# Altium project CSU_Module.PrjPCB
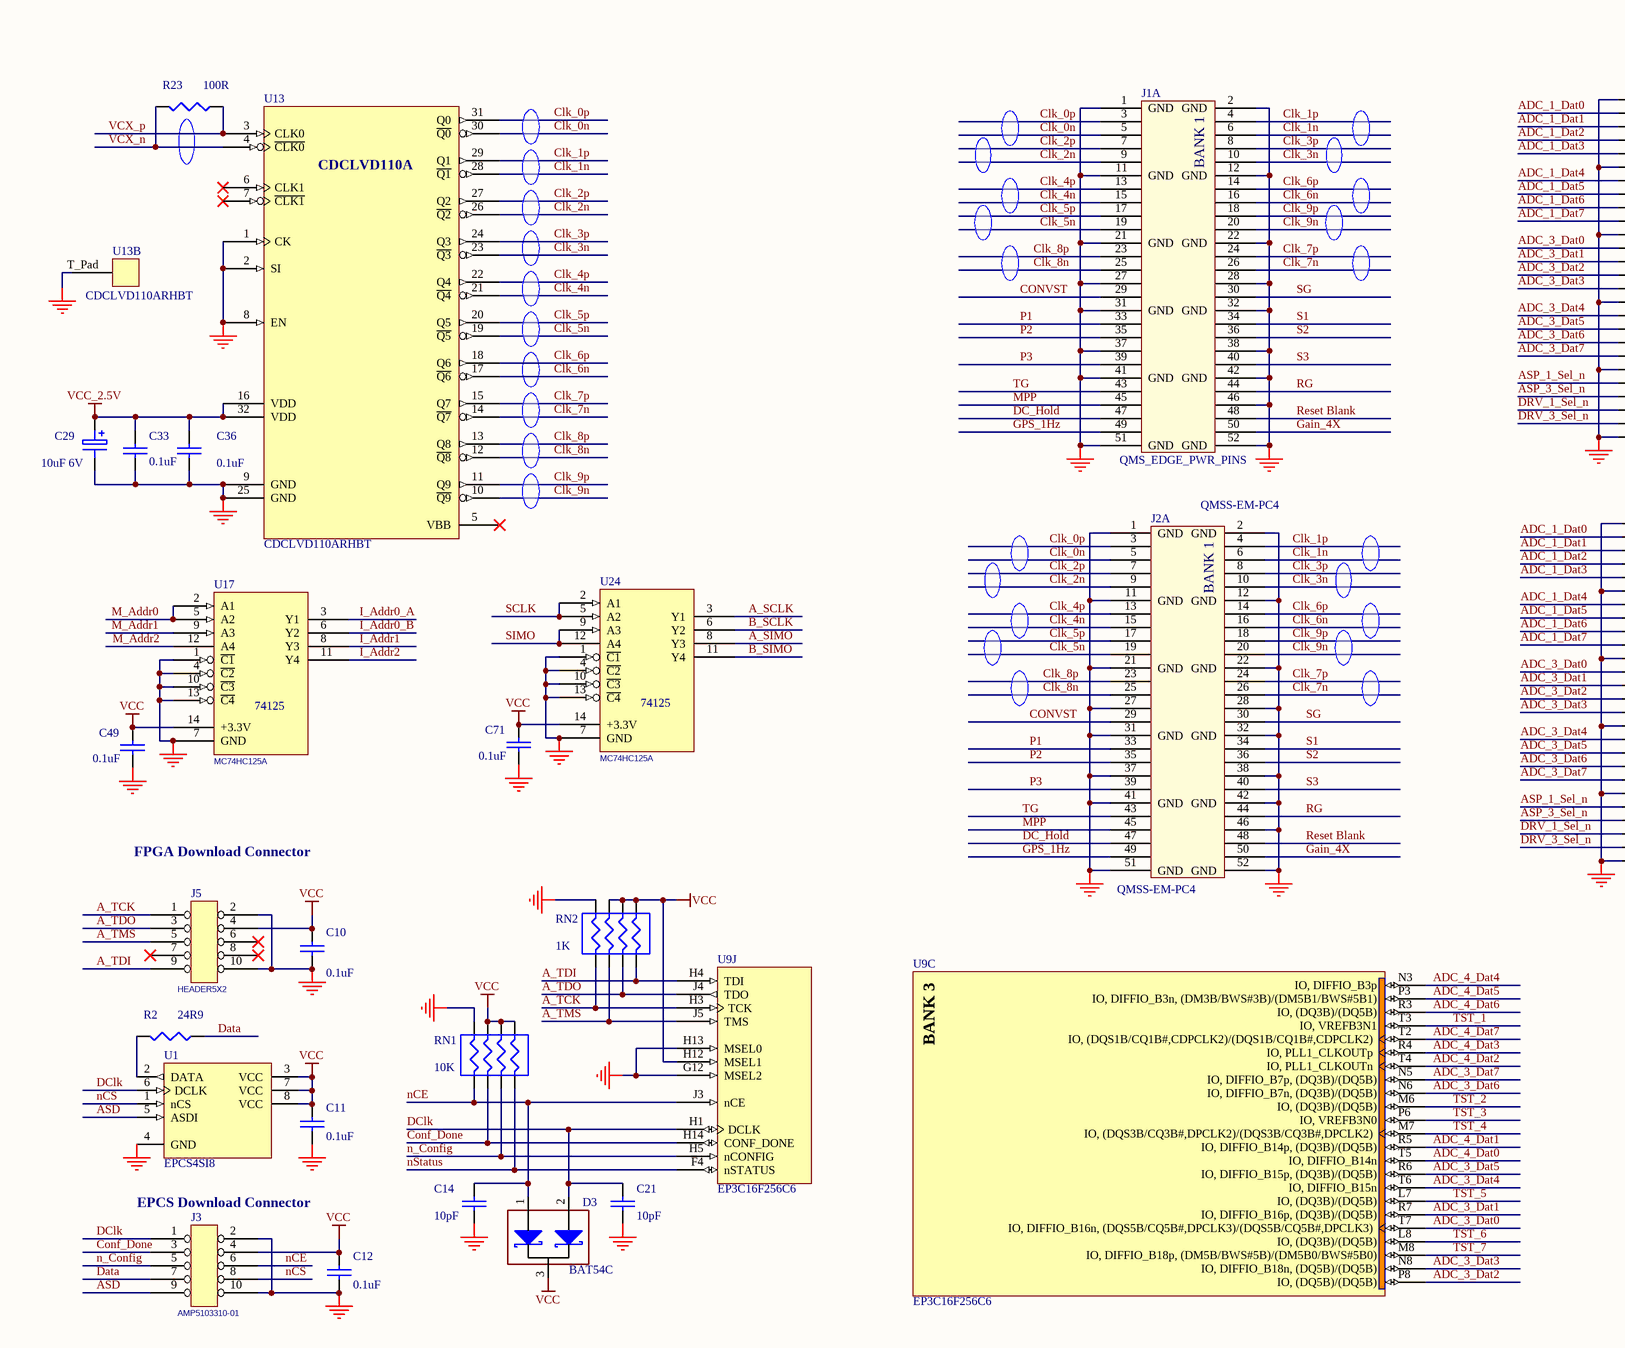
[diagram p0: CSU_FPGA_INTERFACE.SchDoc, top left]
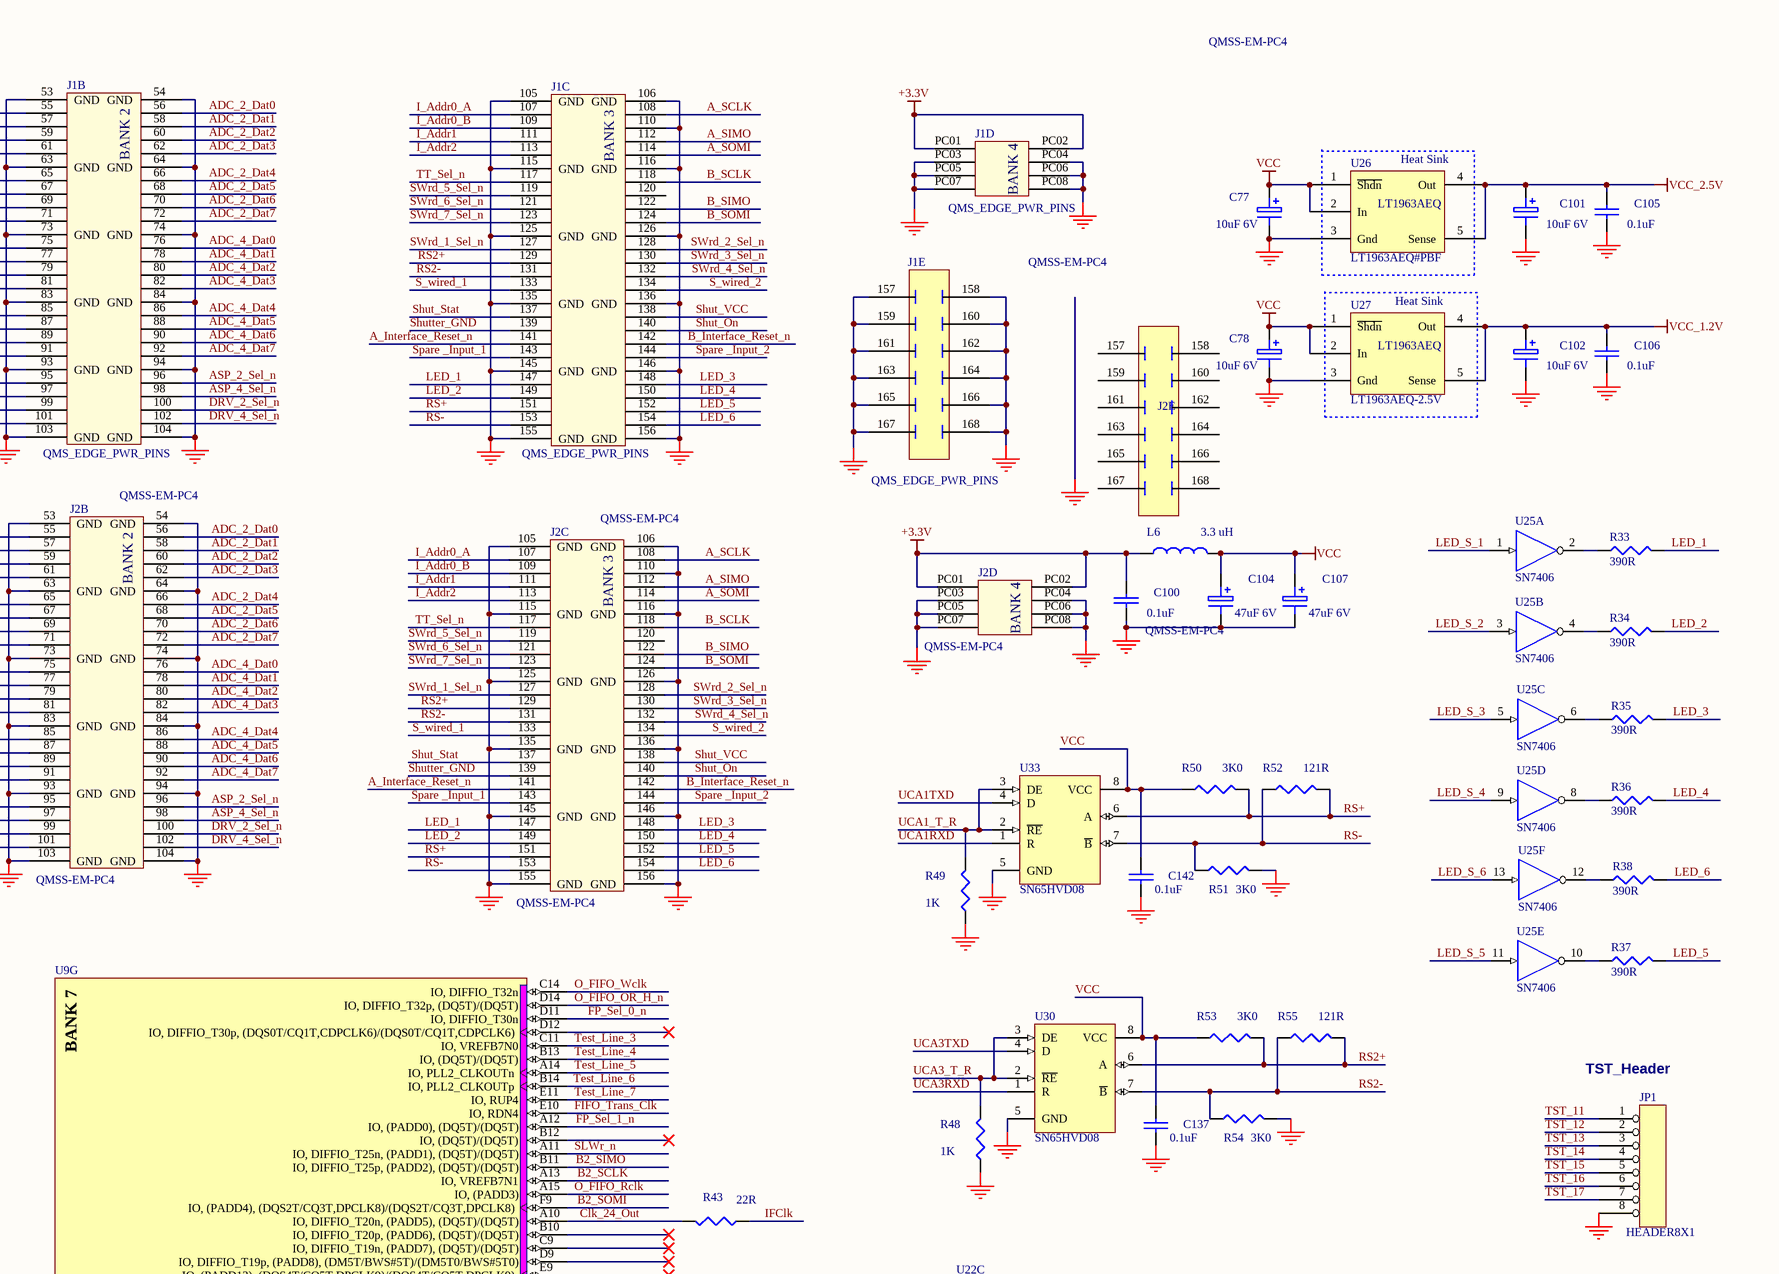
[diagram p1: CSU_FPGA_INTERFACE.SchDoc, top right]
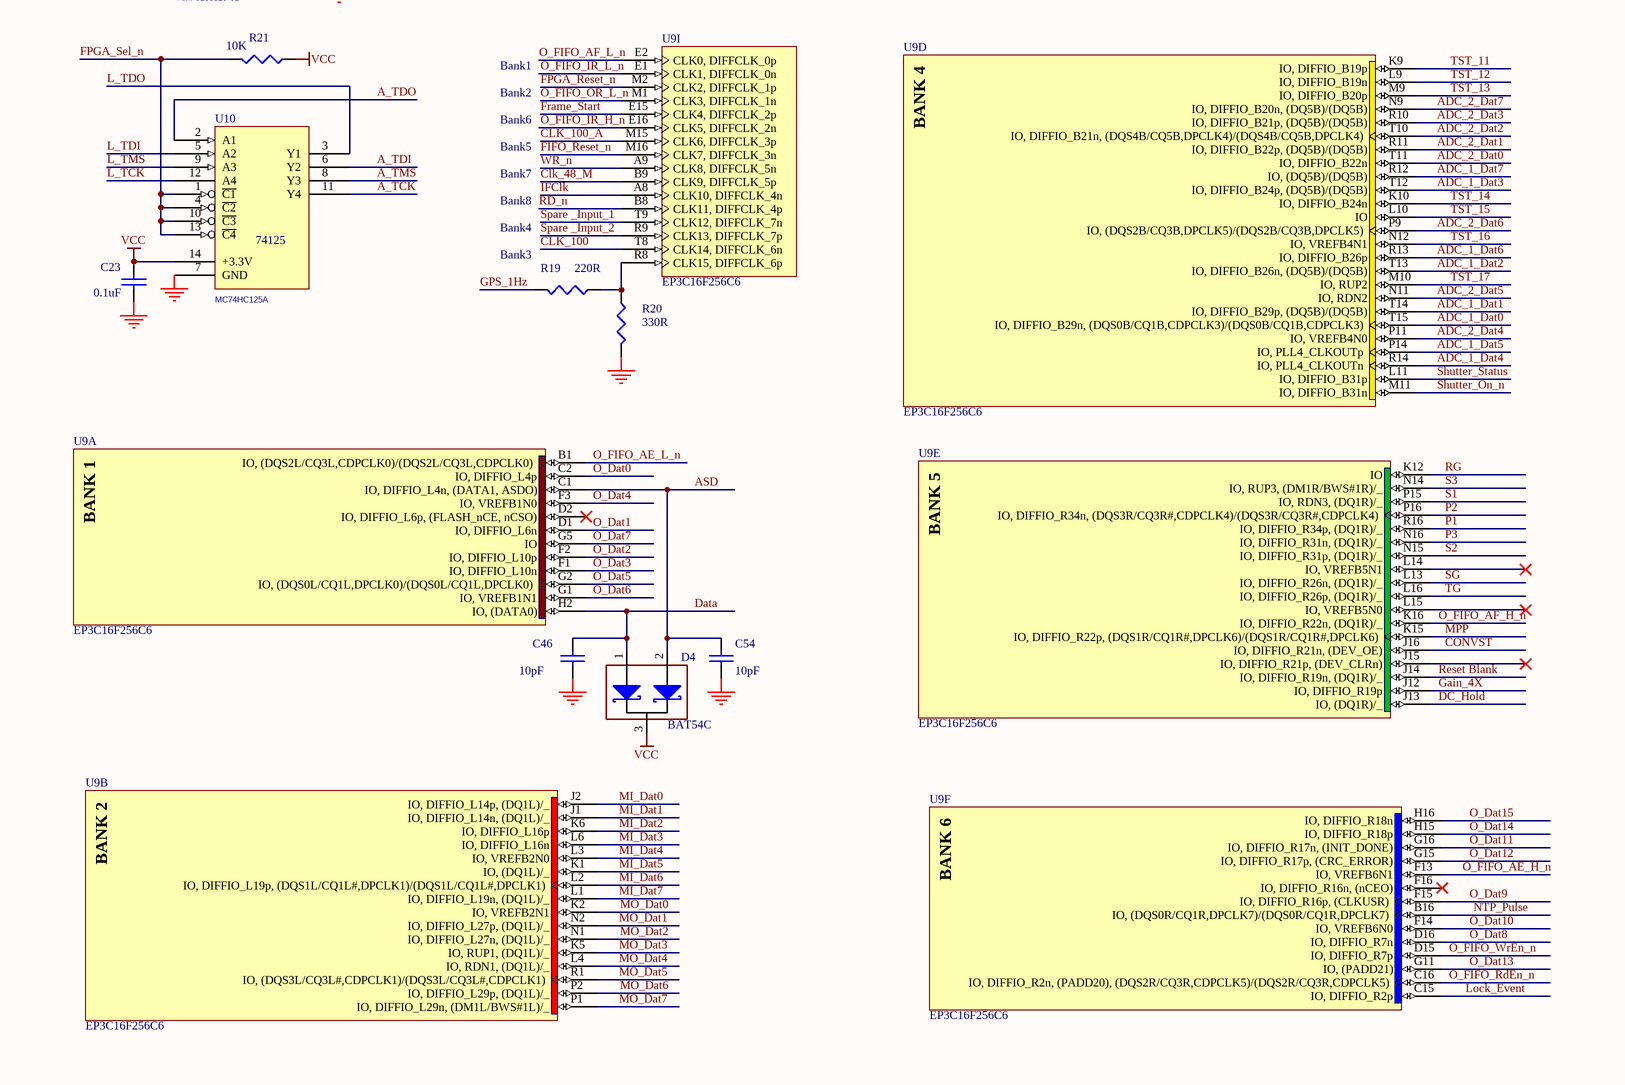
[diagram p2: CSU_FPGA_INTERFACE.SchDoc, bottom left]
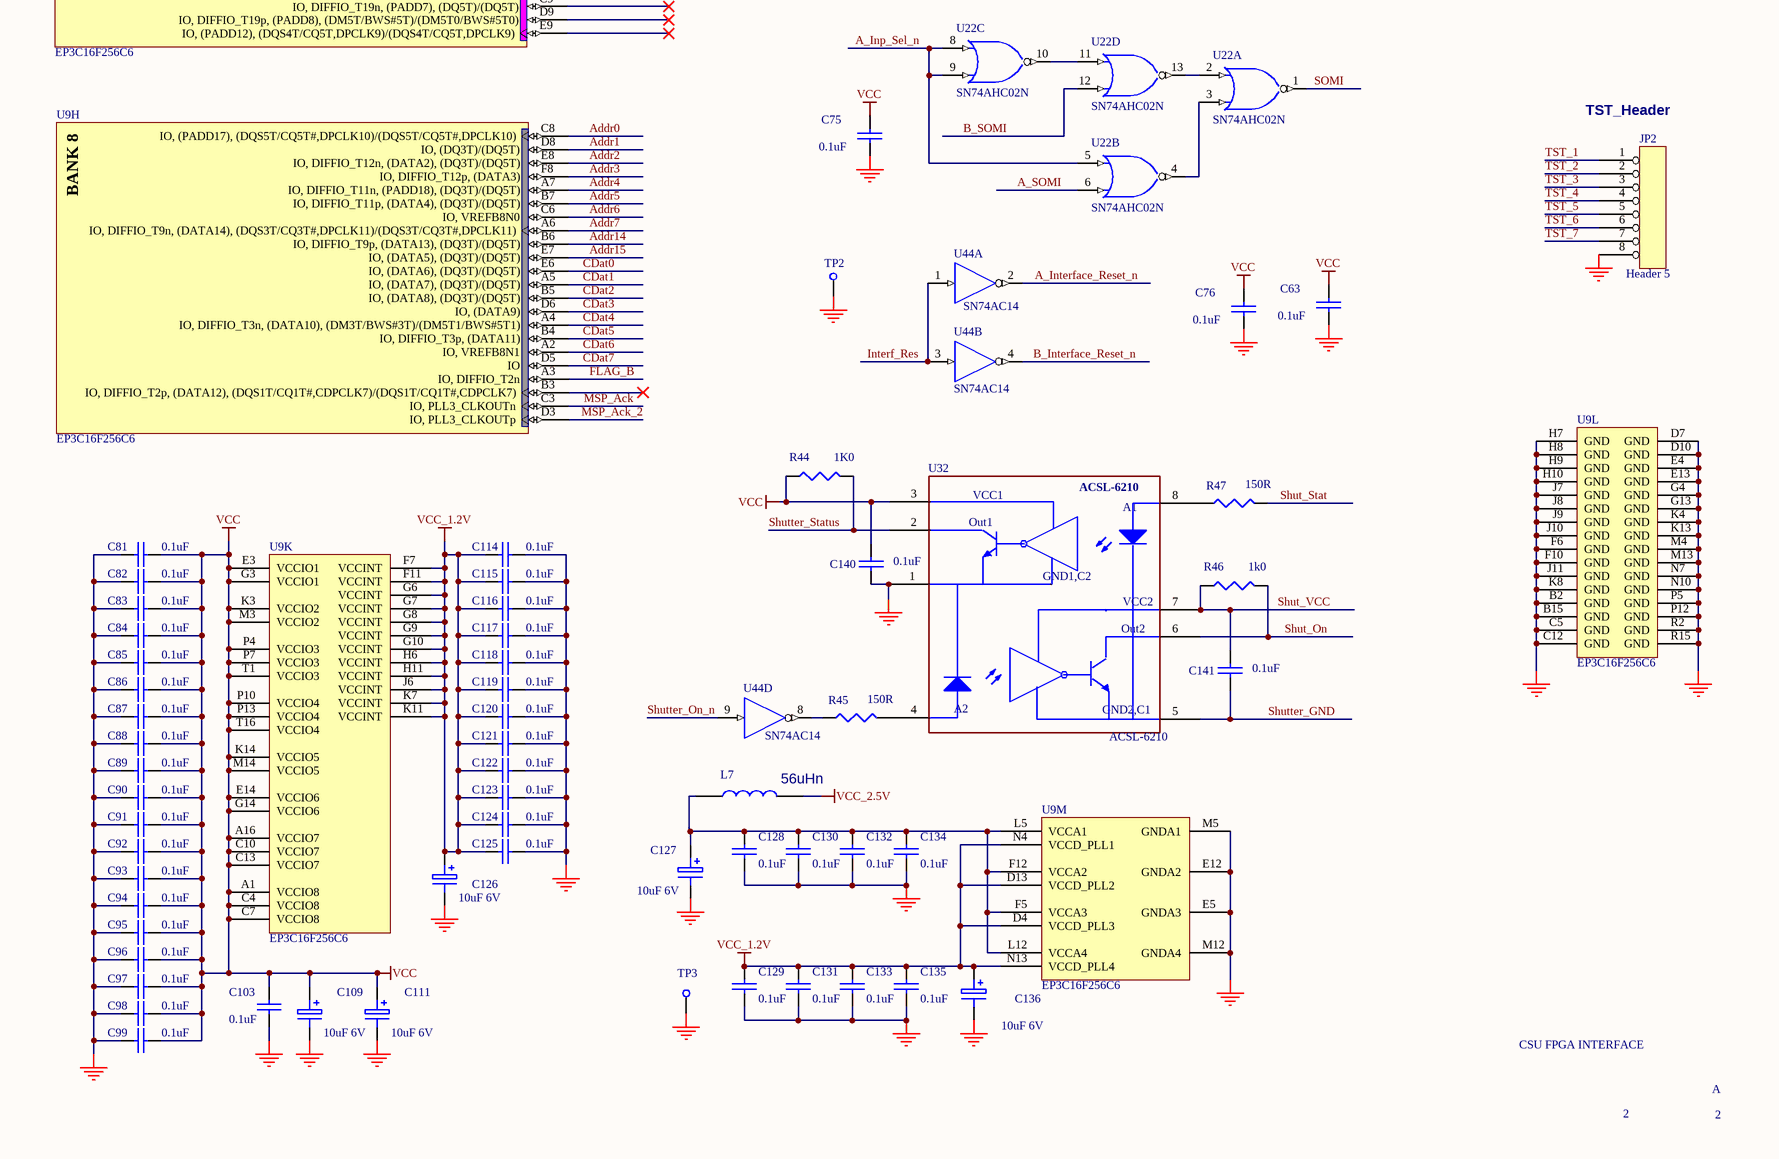
[diagram p3: CSU_FPGA_INTERFACE.SchDoc, bottom right]
1 sheet, 127 parts. Net scope: global (net labels, ports and power ports of the same name join across sheets).

## Sheet CSU_FPGA_INTERFACE.SchDoc
size 645 x 447 mm; PageSetup: Record=PageOptions|CenterHorizontal=True|CenterVertical=True|PrintScale=2.27|XCorrection=1.00|YCorrection=1.00|PrintKind=0|BorderSize=5000000|LeftOffset=0|BottomOffset=0|Orientation=2|PaperLength=1000|PaperWidth=1000|Scale=100|PaperSource=7|PrintQuality=600|MediaType=1|DitherType=10|PaperKind=Letter 8.5 x 11in|PrintScaleMode=1

### Parts
(Parts that share a designator on the sheet are numbered #1, #2 ... from top to bottom, then left to right.)
C10  0.1uF  [0603]
C11  0.1uF  [0603]
C12  0.1uF  [0603]
C14  10pF  [0603]
C21  10pF  [0603]
C23  0.1uF  [0603]
C29  10uF 6V  [3216-18]
C33  0.1uF  [0603]
C36  0.1uF  [0603]
C46  10pF  [0603]
C49  0.1uF  [0603]
C54  10pF  [0603]
C63  0.1uF  [0603]
C71  0.1uF  [0603]
C75  0.1uF  [0603]
C76  0.1uF  [0603]
C77  10uF 6V  [3216-18]
C78  10uF 6V  [3216-18]
C81  0.1uF  [0603]
C82  0.1uF  [0603]
C83  0.1uF  [0603]
C84  0.1uF  [0603]
C85  0.1uF  [0603]
C86  0.1uF  [0603]
C87  0.1uF  [0603]
C88  0.1uF  [0603]
C89  0.1uF  [0603]
C90  0.1uF  [0603]
C91  0.1uF  [0603]
C92  0.1uF  [0603]
C93  0.1uF  [0603]
C94  0.1uF  [0603]
C95  0.1uF  [0603]
C96  0.1uF  [0603]
C97  0.1uF  [0603]
C98  0.1uF  [0603]
C99  0.1uF  [0603]
C100  0.1uF  [0603]
C101  10uF 6V  [3216-18]
C102  10uF 6V  [3216-18]
C103  0.1uF  [0603]
C104  47uF 6V  [6032-28]
C105  0.1uF  [0603]
C106  0.1uF  [0603]
C107  47uF 6V  [6032-28]
C109  10uF 6V  [3216-18]
C111  10uF 6V  [3216-18]
C114  0.1uF  [0603]
C115  0.1uF  [0603]
C116  0.1uF  [0603]
C117  0.1uF  [0603]
C118  0.1uF  [0603]
C119  0.1uF  [0603]
C120  0.1uF  [0603]
C121  0.1uF  [0603]
C122  0.1uF  [0603]
C123  0.1uF  [0603]
C124  0.1uF  [0603]
C125  0.1uF  [0603]
C126  10uF 6V  [3216-18]
C127  10uF 6V  [3216-18]
C128  0.1uF  [0603]
C129  0.1uF  [0603]
C130  0.1uF  [0603]
C131  0.1uF  [0603]
C132  0.1uF  [0603]
C133  0.1uF  [0603]
C134  0.1uF  [0603]
C135  0.1uF  [0603]
C136  10uF 6V  [3216-18]
C137  0.1uF  [0603]
C140  0.1uF  [0603]
C141  0.1uF  [0603]
C142  0.1uF  [0603]
D3  BAT54C  [BAT54C-V]
D4  BAT54C  [BAT54C-V]
J1  QMS_EDGE_PWR_PINS  [QMS EDGE PWR PINS]  (parts A,B,C,D,E of 5)
J2  QMSS-EM-PC4  [QMS EDGE PWR PINS]  (parts A,B,C,D,E of 5)
J3  AMP5103310-01  [HEADER5X2]
J5  HEADER5X2  [HEADER5X2]
JP1  HEADER8X1  [HEADER8X1]
JP2  Header 5  [HEADER8X1]
L6  3.3 uH  [MSS7341]
L7  56uHn  [1812]
R2  24R9  [0603]
R19  220R  [0603]
R20  330R  [0603]
R21  10K  [0603]
R23  100R  [0603]
R33  390R  [0805]
R34  390R  [0805]
R35  390R  [0805]
R36  390R  [0805]
R37  390R  [0805]
R38  390R  [0805]
R43  22R  [0603]
R44  1K0  [0805]
R45  150R  [0805]
R46  1k0  [0805]
R47  150R  [0805]
R48  1K  [0805]
R49  1K  [0805]
R50  3K0  [0805]
R51  3K0  [0805]
R52  121R  [0805]
R53  3K0  [0805]
R54  3K0  [0805]
R55  121R  [0805]
RN1  10K  [EXB-38V]
RN2  1K  [EXB-38V]
TP2  Test point  [PAD_80D_052H]  (value not drawn)
TP3  Test point  [PAD_80D_052H]  (value not drawn)
U1  EPCS4SI8  [SO-8]
U9  EP3C16F256C6  [FBGA256-2C]  (parts A,B,C,D,E,F,G,H,I,J,K,L,M of 13)
U10  MC74HC125A  [SO-14]
U13#1  CDCLVD110ARHBT  [S-PVQFN-G32]
U13#2  CDCLVD110ARHBT  [S-PVQFN-G32]  (part B of 2)
U17  MC74HC125A  [SO-14]
U22  SN74AHC02N  [SO-14]  (parts A,B,C,D of 4)
U24  MC74HC125A  [SO-14]
U25  SN7406  [SO-14]  (parts A,B,C,D,E,F of 6)
U26  LT1963AEQ#PBF  [DDPAK5]
U27  LT1963AEQ-2.5V  [DDPAK5]
U30  SN65HVD08  [SO-8]
U32  ACSL-6210  [SO-8]
U33  SN65HVD08  [SO-8]
U44  SN74AC14  [SO-14]  (parts A,B,D of 6)

### Blocks framed on the sheet
Heat Sink: U26
Heat Sink: U27

### Nets
+3.3V: C100.2 J1.PC01 J1.PC02 J2.PC01 J2.PC02 L6.1
GND: C10.2 C11.2 C12.2 C14.2 C21.2 C23.2 C29.2 C33.1 C36.1 C46.2 C49.2 C54.2 C63.1 C71.2 C75.1 C76.1 C77.2 C78.2 C81.2 C82.2 C83.2 C84.2 C85.2 C86.2 C87.2 C88.2 C89.2 C90.2 C91.2 C92.2 C93.2 C94.2 C95.2 C96.2 C97.2 C98.2 C99.2 C100.1 C101.2 C102.2 C103.2 C104.2 C105.1 C106.1 C107.2 C109.2 C111.2 C114.1 C115.1 C116.1 C117.1 C118.1 C119.1 C120.1 C121.1 C122.1 C123.1 C124.1 C125.1 C126.2 C127.2 C128.1 C129.1 C130.1 C131.1 C132.1 C133.1 C134.1 C135.1 C136.2 C137.2 C140.1 C142.2 J1.1(GND) J1.2(GND) J1.11(GND) J1.12(GND) J1.21(GND) J1.22(GND) J1.27 J1.28 J1.31(GND) J1.32(GND) J1.37 J1.38 J1.41(GND) J1.42(GND) J1.46 J1.51(GND) J1.52(GND) J1.53(GND) J1.54(GND) J1.63(GND) J1.64(GND) J1.73(GND) J1.74(GND) J1.83(GND) J1.84(GND) J1.93(GND) J1.94(GND) J1.103(GND) J1.104(GND) J1.105(GND) J1.106(GND) J1.110 J1.115(GND) J1.116(GND) J1.125(GND) J1.126(GND) J1.135(GND) J1.136(GND) J1.145(GND) J1.146(GND) J1.155(GND) J1.156(GND) J1.157(GND) J1.158(GND) J1.159(GND) J1.160(GND) J1.161(GND) J1.162(GND) J1.163(GND) J1.164(GND) J1.165(GND) J1.166(GND) J1.167(GND) J1.168(GND) J1.PC03 J1.PC04 J1.PC05 J1.PC06 J1.PC07 J1.PC08 J2.1(GND) J2.2(GND) J2.11(GND) J2.12(GND) J2.21(GND) J2.22(GND) J2.27 J2.28 J2.31(GND) J2.32(GND) J2.37 J2.38 J2.41(GND) J2.42(GND) J2.46 J2.51(GND) J2.52(GND) J2.53(GND) J2.54(GND) J2.63(GND) J2.64(GND) J2.73(GND) J2.74(GND) J2.83(GND) J2.84(GND) J2.93(GND) J2.94(GND) J2.103(GND) J2.104(GND) J2.105(GND) J2.106(GND) J2.110 J2.115(GND) J2.116(GND) J2.125(GND) J2.126(GND) J2.135(GND) J2.136(GND) J2.145(GND) J2.146(GND) J2.155(GND) J2.156(GND) J2.PC03 J2.PC04 J2.PC05 J2.PC06 J2.PC07 J2.PC08 J3.2 J3.10 J5.2 J5.10 JP1.8 JP2.8 R20.1(TOP) R48.1 R49.1 R51.2 R54.2 RN1.8 RN2.8 TP2.1(TP) TP3.1(TP) U1.4(GND) U9.B2(GND) U9.B15(GND) U9.C5(GND) U9.C12(GND) U9.D7(GND) U9.D10(GND) U9.E4(GND) U9.E5(GNDA3) U9.E12(GNDA2) U9.E13(GND) U9.F6(GND) U9.F10(GND) U9.G4(GND) U9.G12(MSEL2) U9.G13(GND) U9.H7(GND) U9.H8(GND) U9.H9(GND) U9.H10(GND) U9.H13(MSEL0) U9.J7(GND) U9.J8(GND) U9.J9(GND) U9.J10(GND) U9.J11(GND) U9.K4(GND) U9.K8(GND) U9.K13(GND) U9.M4(GND) U9.M5(GNDA1) U9.M12(GNDA4) U9.M13(GND) U9.N7(GND) U9.N10(GND) U9.P5(GND) U9.P12(GND) U9.R2(GND) U9.R15(GND) U10.7(GND) U13#1.1(CK) U13#1.2(SI) U13#1.8(EN) U13#1.9(GND) U13#1.25(GND) U13#2.T_Pad U17.1(~{C1}) U17.4(~{C2}) U17.7(GND) U17.10(~{C3}) U17.13(~{C4}) U22.7(GND) U24.1(~{C1}) U24.4(~{C2}) U24.7(GND) U24.10(~{C3}) U24.13(~{C4}) U25.7(GND) U26.3(Gnd) U27.3(Gnd) U30.5(GND) U32.1 U33.5(GND) U44.7(GND)
VCC: C10.1 C11.1 C12.1 C23.1 C49.1 C63.2 C71.1 C75.2 C76.2 C77.1 C78.1 C81.1 C82.1 C83.1 C84.1 C85.1 C86.1 C87.1 C88.1 C89.1 C90.1 C91.1 C92.1 C93.1 C94.1 C95.1 C96.1 C97.1 C98.1 C99.1 C103.1 C104.1 C107.1 C109.1 C111.1 C137.1 C140.2 C142.1 D3.3 D4.3 J3.4 J5.4 L6.2 R21.2(BOT) R44.2(BOT) R50.1 R53.1 RN1.5 RN1.6 RN1.7 RN2.5 RN2.6 RN2.7 U1.3(VCC) U1.7(VCC) U1.8(VCC) U9.A1(VCCIO8) U9.A16(VCCIO7) U9.C4(VCCIO8) U9.C7(VCCIO8) U9.C10(VCCIO7) U9.C13(VCCIO7) U9.E3(VCCIO1) U9.E14(VCCIO6) U9.G3(VCCIO1) U9.G14(VCCIO6) U9.H12(MSEL1) U9.K3(VCCIO2) U9.K14(VCCIO5) U9.M3(VCCIO2) U9.M14(VCCIO5) U9.P4(VCCIO3) U9.P7(VCCIO3) U9.P10(VCCIO4) U9.P13(VCCIO4) U9.T1(VCCIO3) U9.T16(VCCIO4) U10.14(+3.3V) U17.14(+3.3V) U22.14(VCC) U24.14(+3.3V) U25.14(VCC) U26.1(~{Shdn}) U26.2(In) U27.1(~{Shdn}) U27.2(In) U30.8(VCC) U32.3 U33.8(VCC) U44.14(VCC)
VCC_1.2V: C102.1 C106.2 C114.2 C115.2 C116.2 C117.2 C118.2 C119.2 C120.2 C121.2 C122.2 C123.2 C124.2 C125.2 C126.1 C129.2 C131.2 C133.2 C135.2 C136.1 U9.D4(VCCD_PLL3) U9.D13(VCCD_PLL2) U9.F7(VCCINT) U9.F11(VCCINT) U9.G6(VCCINT) U9.G7(VCCINT) U9.G8(VCCINT) U9.G9(VCCINT) U9.G10(VCCINT) U9.H6(VCCINT) U9.H11(VCCINT) U9.J6(VCCINT) U9.K7(VCCINT) U9.K11(VCCINT) U9.N4(VCCD_PLL1) U9.N13(VCCD_PLL4) U27.4(Out) U27.5(Sense)
VCC_2.5V: C29.1 C33.2 C36.2 C101.1 C105.2 L7.2 U13#1.16(VDD) U13#1.32(VDD) U26.4(Out) U26.5(Sense)
A_Inp_Sel_n: U22.5(A) U22.8(A) U22.9(B)
A_Interface_Reset_n: J1.141 J2.141 U44.2(Y)
A_SCLK: J1.108 J2.108 U24.3(Y1)
A_SIMO: J1.112 J2.112 U24.8(Y3)
A_SOMI: J1.114 J2.114 U22.6(B)
A_TCK: J5.1 RN2.1 U9.H3(TCK) U10.11(Y4)
A_TDI: J5.9 RN2.4 U9.H4(TDI) U10.6(Y2)
A_TDO: J5.3 RN2.3 U9.J4(TDO) U10.2(A1)
A_TMS: J5.5 RN2.2 U9.J5(TMS) U10.8(Y3)
ADC_1_Dat0: J1.55 J2.55 U9.T15(IO,_DIFFIO_B29n,_(DQS0B/CQ1B,CDPCLK3)/(DQS0B/CQ1B,CDPCLK3))
ADC_1_Dat1: J1.57 J2.57 U9.T14(IO,_DIFFIO_B29p,_(DQ5B)/(DQ5B))
ADC_1_Dat2: J1.59 J2.59 U9.T13(IO,_DIFFIO_B26n,_(DQ5B)/(DQ5B))
ADC_1_Dat3: J1.61 J2.61 U9.T12(IO,_DIFFIO_B24p,_(DQ5B)/(DQ5B))
ADC_1_Dat4: J1.65 J2.65 U9.R14(IO,_PLL4_CLKOUTn)
ADC_1_Dat5: J1.67 J2.67 U9.P14(IO,_PLL4_CLKOUTp)
ADC_1_Dat6: J1.69 J2.69 U9.R13(IO,_DIFFIO_B26p)
ADC_1_Dat7: J1.71 J2.71 U9.R12(IO,_(DQ5B)/(DQ5B))
ADC_2_Dat0: J1.56 J2.56 U9.T11(IO,_DIFFIO_B22n)
ADC_2_Dat1: J1.58 J2.58 U9.R11(IO,_DIFFIO_B22p,_(DQ5B)/(DQ5B))
ADC_2_Dat2: J1.60 J2.60 U9.T10(IO,_DIFFIO_B21n,_(DQS4B/CQ5B,DPCLK4)/(DQS4B/CQ5B,DPCLK4))
ADC_2_Dat3: J1.62 J2.62 U9.R10(IO,_DIFFIO_B21p,_(DQ5B)/(DQ5B))
ADC_2_Dat4: J1.66 J2.66 U9.P11(IO,_VREFB4N0)
ADC_2_Dat5: J1.68 J2.68 U9.N11(IO,_RDN2)
ADC_2_Dat6: J1.70 J2.70 U9.P9(IO,_(DQS2B/CQ3B,DPCLK5)/(DQS2B/CQ3B,DPCLK5))
ADC_2_Dat7: J1.72 J2.72 U9.N9(IO,_DIFFIO_B20n,_(DQ5B)/(DQ5B))
ADC_3_Dat0: J1.75 J2.75 U9.T7(IO,_DIFFIO_B16n,_(DQS5B/CQ5B#,DPCLK3)/(DQS5B/CQ5B#,DPCLK3))
ADC_3_Dat1: J1.77 J2.77 U9.R7(IO,_DIFFIO_B16p,_(DQ3B)/(DQ5B))
ADC_3_Dat2: J1.79 J2.79 U9.P8(IO,_(DQ5B)/(DQ5B))
ADC_3_Dat3: J1.81 J2.81 U9.N8(IO,_DIFFIO_B18n,_(DQ5B)/(DQ5B))
ADC_3_Dat4: J1.85 J2.85 U9.T6(IO,_DIFFIO_B15n)
ADC_3_Dat5: J1.87 J2.87 U9.R6(IO,_DIFFIO_B15p,_(DQ3B)/(DQ5B))
ADC_3_Dat6: J1.89 J2.89 U9.N6(IO,_DIFFIO_B7n,_(DQ3B)/(DQ5B))
ADC_3_Dat7: J1.91 J2.91 U9.N5(IO,_DIFFIO_B7p,_(DQ3B)/(DQ5B))
ADC_4_Dat0: J1.76 J2.76 U9.T5(IO,_DIFFIO_B14n)
ADC_4_Dat1: J1.78 J2.78 U9.R5(IO,_DIFFIO_B14p,_(DQ3B)/(DQ5B))
ADC_4_Dat2: J1.80 J2.80 U9.T4(IO,_PLL1_CLKOUTn)
ADC_4_Dat3: J1.82 J2.82 U9.R4(IO,_PLL1_CLKOUTp)
ADC_4_Dat4: J1.86 J2.86 U9.N3(IO,_DIFFIO_B3p)
ADC_4_Dat5: J1.88 J2.88 U9.P3(IO,_DIFFIO_B3n,_(DM3B/BWS#3B)/(DM5B1/BWS#5B1))
ADC_4_Dat6: J1.90 J2.90 U9.R3(IO,_(DQ3B)/(DQ5B))
ADC_4_Dat7: J1.92 J2.92 U9.T2(IO,_(DQS1B/CQ1B#,CDPCLK2)/(DQS1B/CQ1B#,CDPCLK2))
Addr0: U9.C8(IO,_(PADD17),_(DQS5T/CQ5T#,DPCLK10)/(DQS5T/CQ5T#,DPCLK10))
Addr1: U9.D8(IO,_(DQ3T)/(DQ5T))
Addr2: U9.E8(IO,_DIFFIO_T12n,_(DATA2),_(DQ3T)/(DQ5T))
Addr3: U9.F8(IO,_DIFFIO_T12p,_(DATA3))
Addr4: U9.A7(IO,_DIFFIO_T11n,_(PADD18),_(DQ3T)/(DQ5T))
Addr5: U9.B7(IO,_DIFFIO_T11p,_(DATA4),_(DQ3T)/(DQ5T))
Addr6: U9.C6(IO,_VREFB8N0)
Addr7: U9.A6(IO,_DIFFIO_T9n,_(DATA14),_(DQS3T/CQ3T#,DPCLK11)/(DQS3T/CQ3T#,DPCLK11))
Addr14: U9.B6(IO,_DIFFIO_T9p,_(DATA13),_(DQ3T)/(DQ5T))
Addr15: U9.E7(IO,_(DATA5),_(DQ3T)/(DQ5T))
ASD: C54.1 D4.2 J3.9 U1.5(ASDI) U9.C1(IO,_DIFFIO_L4n,_(DATA1,_ASDO))
ASP_1_Sel_n: J1.95 J2.95
ASP_2_Sel_n: J1.96 J2.96
ASP_3_Sel_n: J1.97 J2.97
ASP_4_Sel_n: J1.98 J2.98
B2_SCLK: U9.A13(IO,_VREFB7N1)
B2_SIMO: U9.B11(IO,_DIFFIO_T25p,_(PADD2),_(DQ5T)/(DQ5T))
B2_SOMI: U9.F9(IO,_(PADD4),_(DQS2T/CQ3T,DPCLK8)/(DQS2T/CQ3T,DPCLK8))
B_Interface_Reset_n: J1.142 J2.142 U44.4(Y)
B_SCLK: J1.118 J2.118 U24.6(Y2)
B_SIMO: J1.122 J2.122 U24.11(Y4)
B_SOMI: J1.124 J2.124 U22.12(B)
CDat0: U9.E6(IO,_(DATA6),_(DQ3T)/(DQ5T))
CDat1: U9.A5(IO,_(DATA7),_(DQ3T)/(DQ5T))
CDat2: U9.B5(IO,_(DATA8),_(DQ3T)/(DQ5T))
CDat3: U9.D6(IO,_(DATA9))
CDat4: U9.A4(IO,_DIFFIO_T3n,_(DATA10),_(DM3T/BWS#3T)/(DM5T1/BWS#5T1))
CDat5: U9.B4(IO,_DIFFIO_T3p,_(DATA11))
CDat6: U9.A2(IO,_VREFB8N1)
CDat7: U9.D5(IO)
Clk_0n: J1.5 J2.5 U13#1.30(~{Q0})
Clk_0p: J1.3 J2.3 U13#1.31(Q0)
Clk_1n: J1.6 J2.6 U13#1.28(~{Q1})
Clk_1p: J1.4 J2.4 U13#1.29(Q1)
Clk_2n: J1.9 J2.9 U13#1.26(~{Q2})
Clk_2p: J1.7 J2.7 U13#1.27(Q2)
Clk_3n: J1.10 J2.10 U13#1.23(~{Q3})
Clk_3p: J1.8 J2.8 U13#1.24(Q3)
Clk_4n: J1.15 J2.15 U13#1.21(~{Q4})
Clk_4p: J1.13 J2.13 U13#1.22(Q4)
Clk_5n: J1.19 J2.19 U13#1.19(~{Q5})
Clk_5p: J1.17 J2.17 U13#1.20(Q5)
Clk_6n: J1.16 J2.16 U13#1.17(~{Q6})
Clk_6p: J1.14 J2.14 U13#1.18(Q6)
Clk_7n: J1.26 J2.26 U13#1.14(~{Q7})
Clk_7p: J1.24 J2.24 U13#1.15(Q7)
Clk_8n: J1.25 J2.25 U13#1.12(~{Q8})
Clk_8p: J1.23 J2.23 U13#1.13(Q8)
Clk_9n: J1.20 J2.20 U13#1.10(~{Q9})
Clk_9p: J1.18 J2.18 U13#1.11(Q9)
Clk_24_Out: R43.1(TOP) U9.A10(IO,_DIFFIO_T20n,_(PADD5),_(DQ5T)/(DQ5T))
Clk_48_M: U9.B9(CLK9,_DIFFCLK_5p)
CLK_100: U9.T8(CLK14,_DIFFCLK_6n)
CLK_100_A: U9.M15(CLK6,_DIFFCLK_3p)
Conf_Done: J3.3 RN1.2 U9.H14(CONF_DONE)
CONVST: J1.29 J2.29 U9.J16(IO,_DIFFIO_R21n,_(DEV_OE))
Data: C46.1 D4.1 J3.7 R2.2(BOT) U9.H2(IO,_(DATA0))
DC_Hold: J1.47 J2.47 U9.J13(IO,_(DQ1R)/_)
DClk: C21.1 D3.2 J3.1 U1.6(DCLK) U9.H1(DCLK)
DRV_1_Sel_n: J1.99 J2.99
DRV_2_Sel_n: J1.100 J2.100
DRV_3_Sel_n: J1.101 J2.101
DRV_4_Sel_n: J1.102 J2.102
FIFO_Reset_n: U9.M16(CLK7,_DIFFCLK_3n)
FIFO_Trans_Clk: U9.E10(IO,_RDN4)
FLAG_B: U9.A3(IO,_DIFFIO_T2n)
FP_Sel_0_n: U9.D11(IO,_DIFFIO_T30n)
FP_Sel_1_n: U9.A12(IO,_(PADD0),_(DQ5T)/(DQ5T))
FPGA_Reset_n: U9.M2(CLK2,_DIFFCLK_1p)
FPGA_Sel_n: R21.1(TOP) U10.1(~{C1}) U10.4(~{C2}) U10.10(~{C3}) U10.13(~{C4})
Frame_Start: U9.E15(CLK4,_DIFFCLK_2p)
Gain_4X: J1.50 J2.50 U9.J12(IO,_DIFFIO_R19p)
GPS_1Hz: J1.49 J2.49 R19.1(TOP)
I_Addr0_A: J1.107 J2.107 U17.3(Y1)
I_Addr0_B: J1.109 J2.109 U17.6(Y2)
I_Addr1: J1.111 J2.111 U17.8(Y3)
I_Addr2: J1.113 J2.113 U17.11(Y4)
IFClk: R43.2(BOT) U9.A8(CLK10,_DIFFCLK_4n)
Interf_Res: U44.1(A) U44.3(A)
L_TCK: U10.12(A4)
L_TDI: U10.5(A2)
L_TDO: U10.3(Y1)
L_TMS: U10.9(A3)
LED_1: J1.147 J2.147 R33.1(TOP)
LED_2: J1.149 J2.149 R34.1(TOP)
LED_3: J1.148 J2.148 R35.1(TOP)
LED_4: J1.150 J2.150 R36.1(TOP)
LED_5: J1.152 J2.152 R37.1(TOP)
LED_6: J1.154 J2.154 R38.1(TOP)
LED_S_1: U25.1(A)
LED_S_2: U25.3(A)
LED_S_3: U25.5(A)
LED_S_4: U25.9(A)
LED_S_5: U25.11(A)
LED_S_6: U25.13(A)
Lock_Event: U9.C15(IO,_DIFFIO_R2p)
M_Addr0: U17.2(A1) U17.5(A2)
M_Addr1: U17.9(A3)
M_Addr2: U17.12(A4)
MI_Dat0: U9.J2(IO,_DIFFIO_L14p,_(DQ1L)/_)
MI_Dat1: U9.J1(IO,_DIFFIO_L14n,_(DQ1L)/_)
MI_Dat2: U9.K6(IO,_DIFFIO_L16p)
MI_Dat3: U9.L6(IO,_DIFFIO_L16n)
MI_Dat4: U9.L3(IO,_VREFB2N0)
MI_Dat5: U9.K1(IO,_(DQ1L)/_)
MI_Dat6: U9.L2(IO,_DIFFIO_L19p,_(DQS1L/CQ1L#,DPCLK1)/(DQS1L/CQ1L#,DPCLK1))
MI_Dat7: U9.L1(IO,_DIFFIO_L19n,_(DQ1L)/_)
MO_Dat0: U9.K2(IO,_VREFB2N1)
MO_Dat1: U9.N2(IO,_DIFFIO_L27p,_(DQ1L)/_)
MO_Dat2: U9.N1(IO,_DIFFIO_L27n,_(DQ1L)/_)
MO_Dat3: U9.K5(IO,_RUP1,_(DQ1L)/_)
MO_Dat4: U9.L4(IO,_RDN1,_(DQ1L)/_)
MO_Dat5: U9.R1(IO,_(DQS3L/CQ3L#,CDPCLK1)/(DQS3L/CQ3L#,CDPCLK1))
MO_Dat6: U9.P2(IO,_DIFFIO_L29p,_(DQ1L)/_)
MO_Dat7: U9.P1(IO,_DIFFIO_L29n,_(DM1L/BWS#1L)/_)
MPP: J1.45 J2.45 U9.K15(IO,_DIFFIO_R22p,_(DQS1R/CQ1R#,DPCLK6)/(DQS1R/CQ1R#,DPCLK6))
MSP_Ack: U9.C3(IO,_PLL3_CLKOUTn)
MSP_Ack_2: U9.D3(IO,_PLL3_CLKOUTp)
n_Config: J3.5 RN1.3 U9.H5(nCONFIG)
nCE: C14.1 D3.1 J3.6 RN1.1 U9.J3(nCE)
nCS: J3.8 U1.1(nCS)
nStatus: RN1.4 U9.F4(nSTATUS)
NTP_Pulse: U9.B16(IO,_(DQS0R/CQ1R,DPCLK7)/(DQS0R/CQ1R,DPCLK7))
O_Dat0: U9.C2(IO,_DIFFIO_L4p)
O_Dat1: U9.D1(IO,_DIFFIO_L6n)
O_Dat2: U9.F2(IO,_DIFFIO_L10p)
O_Dat3: U9.F1(IO,_DIFFIO_L10n)
O_Dat4: U9.F3(IO,_VREFB1N0)
O_Dat5: U9.G2(IO,_(DQS0L/CQ1L,DPCLK0)/(DQS0L/CQ1L,DPCLK0))
O_Dat6: U9.G1(IO,_VREFB1N1)
O_Dat7: U9.G5(IO)
O_Dat8: U9.D16(IO,_DIFFIO_R7n)
O_Dat9: U9.F15(IO,_DIFFIO_R16p,_(CLKUSR))
O_Dat10: U9.F14(IO,_VREFB6N0)
O_Dat11: U9.G16(IO,_DIFFIO_R17n,_(INIT_DONE))
O_Dat12: U9.G15(IO,_DIFFIO_R17p,_(CRC_ERROR))
O_Dat13: U9.G11(IO,_(PADD21))
O_Dat14: U9.H15(IO,_DIFFIO_R18p)
O_Dat15: U9.H16(IO,_DIFFIO_R18n)
O_FIFO_AE_H_n: U9.F13(IO,_VREFB6N1)
O_FIFO_AE_L_n: U9.B1(IO,_(DQS2L/CQ3L,CDPCLK0)/(DQS2L/CQ3L,CDPCLK0))
O_FIFO_AF_H_n: U9.K16(IO,_DIFFIO_R22n,_(DQ1R)/_)
O_FIFO_AF_L_n: U9.E2(CLK0,_DIFFCLK_0p)
O_FIFO_IR_H_n: U9.E16(CLK5,_DIFFCLK_2n)
O_FIFO_IR_L_n: U9.E1(CLK1,_DIFFCLK_0n)
O_FIFO_OR_H_n: U9.D14(IO,_DIFFIO_T32p,_(DQ5T)/(DQ5T))
O_FIFO_OR_L_n: U9.M1(CLK3,_DIFFCLK_1n)
O_FIFO_Rclk: U9.A15(IO,_(PADD3))
O_FIFO_RdEn_n: U9.C16(IO,_DIFFIO_R2n,_(PADD20),_(DQS2R/CQ3R,CDPCLK5)/(DQS2R/CQ3R,CDPCLK5))
O_FIFO_Wclk: U9.C14(IO,_DIFFIO_T32n)
O_FIFO_WrEn_n: U9.D15(IO,_DIFFIO_R7p)
P1: J1.33 J2.33 U9.R16(IO,_DIFFIO_R34p,_(DQ1R)/_)
P2: J1.35 J2.35 U9.P16(IO,_DIFFIO_R34n,_(DQS3R/CQ3R#,CDPCLK4)/(DQS3R/CQ3R#,CDPCLK4))
P3: J1.39 J2.39 U9.N16(IO,_DIFFIO_R31n,_(DQ1R)/_)
RD_n: U9.B8(CLK11,_DIFFCLK_4p)
Reset Blank: J1.48 J2.48 U9.J14(IO,_DIFFIO_R19n,_(DQ1R)/_)
RG: J1.44 J2.44 U9.K12(IO)
RS2+: J1.129 J2.129 R53.2 R55.2 U30.6(A)
RS2-: J1.131 J2.131 R54.1 R55.1 U30.7(~{B})
RS+: J1.151 J2.151 R50.2 R52.2 U33.6(A)
RS-: J1.153 J2.153 R51.1 R52.1 U33.7(~{B})
S1: J1.34 J2.34 U9.P15(IO,_RDN3,_(DQ1R)/_)
S2: J1.36 J2.36 U9.N15(IO,_DIFFIO_R31p,_(DQ1R)/_)
S3: J1.40 J2.40 U9.N14(IO,_RUP3,_(DM1R/BWS#1R)/_)
S_wired_1: J1.133 J2.133
S_wired_2: J1.134 J2.134
SCLK: U24.2(A1) U24.5(A2)
SG: J1.30 J2.30 U9.L13(IO,_DIFFIO_R26n,_(DQ1R)/_)
Shut_On: J1.140 J2.140 R46.1(TOP) U32.6
Shut_Stat: J1.137 J2.137 R47.1(TOP)
Shut_VCC: C141.2 J1.138 J2.138 R46.2(BOT) U32.7
Shutter_GND: C141.1 J1.139 J2.139 U32.5
Shutter_On_n: U9.M11(IO,_DIFFIO_B31n) U44.9(A)
Shutter_Status: R44.1(TOP) U9.L11(IO,_DIFFIO_B31p) U32.2
SIMO: U24.9(A3) U24.12(A4)
SLWr_n: U9.A11(IO,_DIFFIO_T25n,_(PADD1),_(DQ5T)/(DQ5T))
SOMI: U22.1(Y)
Spare _Input_1: J1.143 J2.143 U9.T9(CLK12,_DIFFCLK_7n)
Spare _Input_2: J1.144 J2.144 U9.R9(CLK13,_DIFFCLK_7p)
SWrd_1_Sel_n: J1.127 J2.127
SWrd_2_Sel_n: J1.128 J2.128
SWrd_3_Sel_n: J1.130 J2.130
SWrd_4_Sel_n: J1.132 J2.132
SWrd_5_Sel_n: J1.119 J2.119
SWrd_6_Sel_n: J1.121 J2.121
SWrd_7_Sel_n: J1.123 J2.123
Test_Line_3: U9.C11(IO,_VREFB7N0)
Test_Line_4: U9.B13(IO,_(DQ5T)/(DQ5T))
Test_Line_5: U9.A14(IO,_PLL2_CLKOUTn)
Test_Line_6: U9.B14(IO,_PLL2_CLKOUTp)
Test_Line_7: U9.E11(IO,_RUP4)
TG: J1.43 J2.43 U9.L16(IO,_DIFFIO_R26p,_(DQ1R)/_)
TST_1: JP2.1 U9.T3(IO,_VREFB3N1)
TST_2: JP2.2 U9.M6(IO,_(DQ3B)/(DQ5B))
TST_3: JP2.3 U9.P6(IO,_VREFB3N0)
TST_4: JP2.4 U9.M7(IO,_(DQS3B/CQ3B#,DPCLK2)/(DQS3B/CQ3B#,DPCLK2))
TST_5: JP2.5 U9.L7(IO,_(DQ3B)/(DQ5B))
TST_6: JP2.6 U9.L8(IO,_(DQ3B)/(DQ5B))
TST_7: JP2.7 U9.M8(IO,_DIFFIO_B18p,_(DM5B/BWS#5B)/(DM5B0/BWS#5B0))
TST_11: JP1.1 U9.K9(IO,_DIFFIO_B19p)
TST_12: JP1.2 U9.L9(IO,_DIFFIO_B19n)
TST_13: JP1.3 U9.M9(IO,_DIFFIO_B20p)
TST_14: JP1.4 U9.K10(IO,_DIFFIO_B24n)
TST_15: JP1.5 U9.L10(IO)
TST_16: JP1.6 U9.N12(IO,_VREFB4N1)
TST_17: JP1.7 U9.M10(IO,_RUP2)
TT_Sel_n: J1.117 J2.117
UCA1_T_R: R49.2 U33.2(~{RE}) U33.3(DE)
UCA1RXD: U33.1(R)
UCA1TXD: U33.4(D)
UCA3_T_R: R48.2 U30.2(~{RE}) U30.3(DE)
UCA3RXD: U30.1(R)
UCA3TXD: U30.4(D)
VCX_n: R23.1(TOP) U13#1.4(~{CLK0})
VCX_p: R23.2(BOT) U13#1.3(CLK0)
WR_n: U9.A9(CLK8,_DIFFCLK_5n)
NetC127_1: C127.1 C128.2 C130.2 C132.2 C134.2 L7.1 U9.F5(VCCA3) U9.F12(VCCA2) U9.L5(VCCA1) U9.L12(VCCA4)
NetR2_1: R2.1(TOP) U1.2(DATA)
NetR19_2: R19.2(BOT) R20.2(BOT) U9.R8(CLK15,_DIFFCLK_6p)
NetR33_2: R33.2(BOT) U25.2(Y)
NetR34_2: R34.2(BOT) U25.4(Y)
NetR35_2: R35.2(BOT) U25.6(Y)
NetR36_2: R36.2(BOT) U25.8(Y)
NetR37_2: R37.2(BOT) U25.10(Y)
NetR38_2: R38.2(BOT) U25.12(Y)
NetR45_1: R45.1(TOP) U32.4
NetR45_2: R45.2(BOT) U44.8(Y)
NetR47_2: R47.2(BOT) U32.8
NetU22_2: U22.2(A) U22.13(Y)
NetU22_3: U22.3(B) U22.4(Y)
NetU22_10: U22.10(Y) U22.11(A)

Not connected (* = marked no-connect by the designer): J1 120; J2 120 157(GND) 158(GND) 159(GND) 160(GND) 161(GND) 162(GND) 163(GND) 164(GND) 165(GND) 166(GND) 167(GND) 168(GND); J5 6* 7* 8*; U9 B3(IO,_DIFFIO_T2p,_(DATA12),_(DQS1T/CQ1T#,CDPCLK7)/(DQS1T/CQ1T#,CDPCLK7))* B10(IO,_DIFFIO_T20p,_(PADD6),_(DQ5T)/(DQ5T))* B12(IO,_(DQ5T)/(DQ5T))* C9(IO,_DIFFIO_T19n,_(PADD7),_(DQ5T)/(DQ5T))* D2(IO,_DIFFIO_L6p,_(FLASH_nCE,_nCSO))* D9(IO,_DIFFIO_T19p,_(PADD8),_(DM5T/BWS#5T)/(DM5T0/BWS#5T0))* D12(IO,_DIFFIO_T30p,_(DQS0T/CQ1T,CDPCLK6)/(DQS0T/CQ1T,CDPCLK6))* E9(IO,_(PADD12),_(DQS4T/CQ5T,DPCLK9)/(DQS4T/CQ5T,DPCLK9))* F16(IO,_DIFFIO_R16n,_(nCEO))* J15(IO,_DIFFIO_R21p,_(DEV_CLRn))* L14(IO,_VREFB5N1)* L15(IO,_VREFB5N0)*; U13#1 5(VBB)* 6(CLK1)* 7(~{CLK1})*

### Notes on the sheet
- FPGA Download Connector
- (near JP1) TST_Header
- (near J3) EPCS Download Connector
- Bank1
- Bank2
- (near JP2) TST_Header
- Bank5
- Bank6
- Bank7
- Bank8
- Bank4
- (near R19) Bank3
- CSU FPGA INTERFACE
- 2
- A
- (in symbol 74ACT125) 74125
- (in symbol EP3C16F256C6, part A) BANK 1
- (in symbol EP3C16F256C6, part B) BANK 2
- (in symbol EP3C16F256C6, part C) BANK 3
- (in symbol EP3C16F256C6, part D) BANK 4
- (in symbol EP3C16F256C6, part E) BANK 5
- (in symbol EP3C16F256C6, part F) BANK 6
- (in symbol EP3C16F256C6, part G) BANK 7
- (in symbol EP3C16F256C6, part H) BANK 8
- (in symbol QMS_EDGE_PWR_PINS, part A) BANK 1
- (in symbol QMS_EDGE_PWR_PINS, part B) BANK 2
- (in symbol QMS_EDGE_PWR_PINS, part C) BANK 3
- (in symbol QMS_EDGE_PWR_PINS, part D) BANK 4
- (in symbol QMSS-EM-PC4, part A) BANK 1
- (in symbol QMSS-EM-PC4, part B) BANK 2
- (in symbol QMSS-EM-PC4, part C) BANK 3
- (in symbol QMSS-EM-PC4, part D) BANK 4

### Library data of the parts
C10-C12 C33 C36 C81-C99 C103 C114-C125 C128-C135 = CAP: Capacitor; Manufacturer: Murata; Manuf p/n: GRM188R71H104KA93D; Vendor: DigiKey; Vendor p/n: 490-1519-1-ND; Vendor Mult.: 10; LCO p/n: 120-00015; Value: 0.1uF; COST: 0.061
C14 C21 C46 C54 = CAP: Capacitor; Manufacturer: Murata; Manuf p/n: GRM1885C1H100JA01D; Vendor: DigiKey; Vendor p/n: 490-1403-1-ND; Vendor Mult.: 10; LCO p/n: 120-00012; Value: 10pF; COST: 0.043
C23 C49 C63 C71 C75 C76 C100 C105 C106 C137 C140-C142 = CAP: Manufacturer: Murata; Manuf p/n: GRM188R71H104KA93D; Vendor: DigiKey; Vendor p/n: 490-1519-1-ND; Vendor Mult.: 10; LCO p/n: 120-00015; Value: 0.1uF; COST: 0.061
C29 C77 C78 C101 C102 C109 C111 C126 C127 C136 = ELECTRO1: Manufacturer: Kemet; Manuf p/n: T491A106K006AT; Vendor: DigiKey; Vendor p/n: 399-3683-1-ND; Vendor Mult.: 10; LCO p/n: 120-00022; Value: 10uF; COST: 0.20
C104 C107 = ELECTRO1: Manufacturer: Kemet; Manuf p/n: T491C476K010AT; Vendor: DigiKey; Vendor p/n: 399-3757-1-ND; Vendor Mult.: 1; LCO p/n: 120-00024; Value: 47uF; COST: 1.30
D3 D4 = BAT54C-V: Manufacturer: FAIRCHILD; Vendor: DigiKey; Vendor p/n: BAT54CFSCT-ND; Vendor Mult.: 10; LCO p/n: 140-00007; Value: BAT54C; COST: 0.13; Manuf p/n: BAT54C
J1 = QMS_EDGE_PWR_PINS: Manufacturer: SAMETC; Manuf p/n: QMSS-078-06.75-L-D-PC4; Vendor Mult.: 1; Value: QMS_EDGE_PWR_PINS; COST: 18.36; Vendor: SAMETC
J2 = QMSS-EM-PC4: SAMTEC QMSS EDGE W/PWR PINS; Manuf p/n: QMSS-078-01-L-D-EM2-PC4; Vendor: SAMETC; Vendor Mult.: 1; LCO p/n: 125-00023; Manufacturer: SAMTEC; Vendor p/n: QMSS-078-01-L-D-EM2-PC4; COST: 20.00; VALUE: QMSS-EM-PC4
J3 J5 = HEADER5X2: Manufacturer: FCI; Manuf p/n: 67996-210HLF; Vendor p/n: 609-3212-ND; Vendor Mult.: 1; LCO p/n: 125-00010; COST: 0.81
  J3: Value: Header 5X2
  J5: Value: HEADER5X2
JP1 JP2 = HEADER8X1: Manufacturer: FCI; Manuf p/n: 68002-208HLF; Vendor p/n: 609-3300-ND; Vendor Mult.: 1; LCO p/n: 125-00026; COST: 0.51
  JP1: Value: HEADER8X1
  JP2: Value: Header 5
L6 = INDUCTOR1: Manufacturer: Coiltronics; Manuf p/n: SD7030-3R3-R; Value: 3.3 uHn; Vendor: DigiKey; Vendor p/n: 513-1481-1-ND; Vendor Mult.: 1; LCO p/n: 155-00007; COST: 1.17
L7 = INDUCTOR1: Manufacturer: Epcos; Manuf p/n: B82432T1563K; Vendor: DigiKey; Vendor p/n: 495-1982-1-ND; Vendor Mult.: 1; LCO p/n: 155-00008; Value: 56uHn; COST: 0.98
R2 = RES: Resistor; Manufacturer: Vishay; Manuf p/n: CRCW060324R9FKEA; Vendor: DigiKey; Vendor p/n: 541-24.9HCT-ND; Vendor Mult.: 10; LCO p/n: 180-00029; Value: 24R9; COST: 0.081
R19 = RES: Resistor; Manufacturer: Vishay; Manuf p/n: CRCW0603220RFKEA; Vendor: DigiKey; Vendor p/n: 541-220HCT-ND; Vendor Mult.: 10; LCO p/n: 180-00027; Value: 220R; COST: 0.081
R20 = RES: Resistor; Manufacturer: Vishay; Manuf p/n: CRCW0603330RFKEA; Vendor: DigiKey; Vendor p/n: 541-330HCT-ND; Vendor Mult.: 10; LCO p/n: 180-00030; Value: 330R; COST: 0.081
R21 = RES: Resistor; Manufacturer: Vishay; Manuf p/n: CRCW060310K0FKEA; Vendor: DigiKey; Vendor p/n: 541-10.0KHCT-ND; Vendor Mult.: 10; LCO p/n: 180-00021; Value: 10K; COST: 0.081
R23 = RES: Resistor; Manufacturer: Vishay; Manuf p/n: CRCW0603100RFKEA; Vendor: DigiKey; Vendor p/n: 541-100HCT-ND; Vendor Mult.: 10; LCO p/n: 180-00020; Value: 100R; COST: 0.081
R33-R38 = RES: Resistor; Manufacturer: Vishay; Manuf p/n: CRCW0805390RFKEA; Vendor: DigiKey; Vendor p/n: 541-390CCT-ND; Vendor Mult.: 10; LCO p/n: 180-00062; Value: 390R; COST: 0.081
R43 = RES: Resistor; Manufacturer: Vishay; Manuf p/n: CRCW060322R0FKEA; Vendor: DigiKey; Vendor p/n: 541-22.0HCT-ND; Vendor Mult.: 10; LCO p/n: 180-00028; Value: 22R; COST: 0.081
R44 R46 = RES: Resistor; Manufacturer: Vishay; Manuf p/n: CRCW08051K00FKEA; Vendor: DigiKey; Vendor p/n: 541-1.00KCCT-ND; Vendor Mult.: 10; LCO p/n: 181-01001; COST: 0.09
  R44: Value: 1K0
  R46: Value: 1k0
R45 R47 = RES: Resistor; Manufacturer: Vishay; Manuf p/n: CRCW0805150rFKEA; Vendor: DigiKey; Vendor p/n: 541-150CCT-ND; Vendor Mult.: 10; LCO p/n: 181-01500; Value: 150R; COST: 0.081
R48 R49 = RES1: Manufacturer: Vishay; Manuf p/n: CRCW08051K00FKEA; Vendor: DigiKey; Vendor p/n: 541-1.00KCCT-ND; Vendor Mult.: 10; LCO p/n: 181-01001; Value: 1K; COST: 0.09
R50 R51 R53 R54 = RES1: Manufacturer: Vishay; Manuf p/n: CRCW08053K00FKEA; Vendor: DigiKey; Vendor p/n: 541-3.00KCCT-ND; Vendor Mult.: 10; LCO p/n: 180-00064; Value: 3K0; COST: 0.089
R52 R55 = RES1: Manufacturer: Vishay; Manuf p/n: CRCW0805121RFKEA; Vendor: DigiKey; Vendor p/n: 541-121CCT-ND; Vendor Mult.: 10; LCO p/n: 181-01210; Value: 121R; COST: 0.081
RN1 = R 4 NET: Manufacturer: Panasonic; Manuf p/n: EXB-38V103JV; Vendor: DigiKey; Vendor p/n: Y9103CT-ND; Vendor Mult.: 10; LCO p/n: 180-00043; Value: 10K; COST: 0.031
RN2 = R 4 NET: Manufacturer: Panasonic; Manuf p/n: EXB-38V102JV; Vendor: DigiKey; Vendor p/n: Y9102CT-ND; Vendor Mult.: 10; LCO p/n: 180-00045; Value: 1K; COST: 0.031
TP2 TP3 = Test point: Manufacturer: Keystone; Manuf p/n: 5001; Vendor: DigiKey; Vendor p/n: 5001K-ND; VALUE: Test point mini; Vendor Mult.: 10; LCO p/n: 125-00014; COST: 0.32
U1 = EPCS4SI8: EPCS4 Series, In-system programmable 3.3V serial configuration device, 8-Pin SOIC, 4-Megabit, Industrial Grade; Manufacturer: Altera; Vendor: DigiKey; Vendor p/n: 544-1243-5-ND; Vendor Mult.: 1; LCO p/n: 150-00034; Value: EPCS4SI8; COST: 13.00; Manuf p/n: EPCS4SI8
U9 = EP3C16F256C6: Cyclone III Family FPGA, 152 I/O Pins, 4 PLLs, 256-Pin FBGA, Speed Grade 6, Commercial Grade; Manufacturer: Altera; Vendor: DigiKey; Vendor p/n: 544-2459-ND; Vendor Mult.: 1; LCO p/n: 150-00033; Value: EP3C16F256C6; COST: 44.40; Manuf p/n: EP3C16F256C6
U10 U17 U24 = 74ACT125: Manufacturer: ON Semi; Manuf p/n: MC74HC125ADG; Vendor: DigiKey; Vendor p/n: MC74HC125ADGOS-ND; Vendor Mult.: 1; LCO p/n: 150-00053; Value: MC74HC125A; COST: 0.50
U13#1 U13#2 = CDCLVD110A: Manufacturer: TI; Vendor: DigiKey; Vendor p/n: 296-23857-1-ND; Notes: Low stock @ DK; Vendor Mult.: 1; LCO p/n: 150-00026; Value: CDCLVD110ARHBT; COST: 10.30; Manuf p/n: CDCLVD110ARHBT
U22 = SN74AHC02N: Quadruple 2-Input Positive-NOR Gate; Manufacturer: TI; Value: SN74AHC02DR; Vendor: DigiKey; Vendor p/n: 296-4511-1-ND; Vendor Mult.: 1; LCO p/n: 150-00061; COST: 0.39; Manuf p/n: SN74AHC02DR
U25 = SN7406N: Hex Inverter Buffer / Driver with High-Voltage Outputs; Manufacturer: TI; Manuf p/n: SN7406DR; Vendor: DigiKey; Vendor p/n: 296-1017-1-ND; Vendor Mult.: 1; LCO p/n: 150-00059; Value: SN7406; COST: 0.96
U26 = LT1963AEQ: Manufacturer: Linear Tech; Vendor: DigiKey; Vendor p/n: LT1963AEQ#PBF-ND; Vendor Mult.: 1; LCO p/n: 150-00045; Value: LT1963AEQ#PBF; COST: 5.50; Manuf p/n: LT1963AEQ#PBF
U27 = LT1963AEQ: Manufacturer: Linear Tech; Manuf p/n: LT1963AEQ-2.5#PBF; Vendor: DigiKey; Vendor p/n: LT1963AEQ-2.5#PBF-ND; Vendor Mult.: 1; LCO p/n: 150-00046; Value: LT1963AEQ-2.5V; COST: 5.50
U30 U33 = SN75ALS176AD: Differential Bus Transceiver; Manufacturer: TI; Manuf p/n: SN65HVD08D; Vendor: DigiKey; Vendor p/n: 296-14010-5-ND; Vendor Mult.: 1; LCO p/n: 150-00058; Value: SN65HVD08; COST: 4.61
U32 = ACSL_6210: Manufacturer: Avago; Manuf p/n: ACSL-6210-00RE; Vendor: DigiKey; Vendor p/n: 516-1602-5-ND; Vendor Mult.: 1; LCO p/n: 150-00019; Value: ACSL_6210; COST: 4.20
U44 = SN54AC14W: Hex Schmitt-Trigger Inverter; Manufacturer: TI; Manuf p/n: SN74AC14DR; Vendor: DigiKey; Vendor p/n: 296-4300-1-ND; Vendor Mult.: 1; LCO p/n: 150-00060; Value: SN74AC14; COST: 0.43